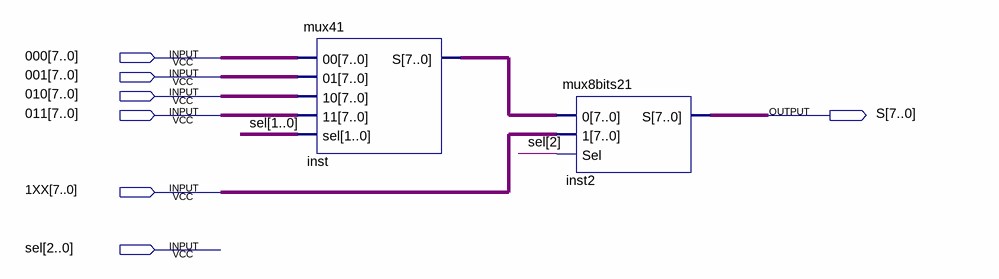
[diagram p0: schematic sheet]
// Quartus schematic mux51.bdf as structural Verilog: 2 symbols, 7 pins
module mux51 (
  input  [7:0] \000 ,
  input  [7:0] \001 ,
  input  [7:0] \010 ,
  input  [7:0] \011 ,
  input  [7:0] \1XX ,
  input  [2:0] sel,
  output [7:0] S
);

  wire [7:0] inst_s;

  mux41 inst (.\00 (\000 ), .\01 (\001 ), .\10 (\010 ), .\11 (\011 ), .sel(sel[1:0]), .S(inst_s));
  mux8bits21 inst2 (.\0 (inst_s), .\1 (\1XX ), .Sel(sel[2]), .S(S));
endmodule
